# Altium schematic sheet NB-Blue.SchDoc
size A3; Organization: Altium Limited; Address1: L3, 12a Rodborough Rd; Address2: Frenchs Forest; Address3: NSW; Address4: Australia 2086
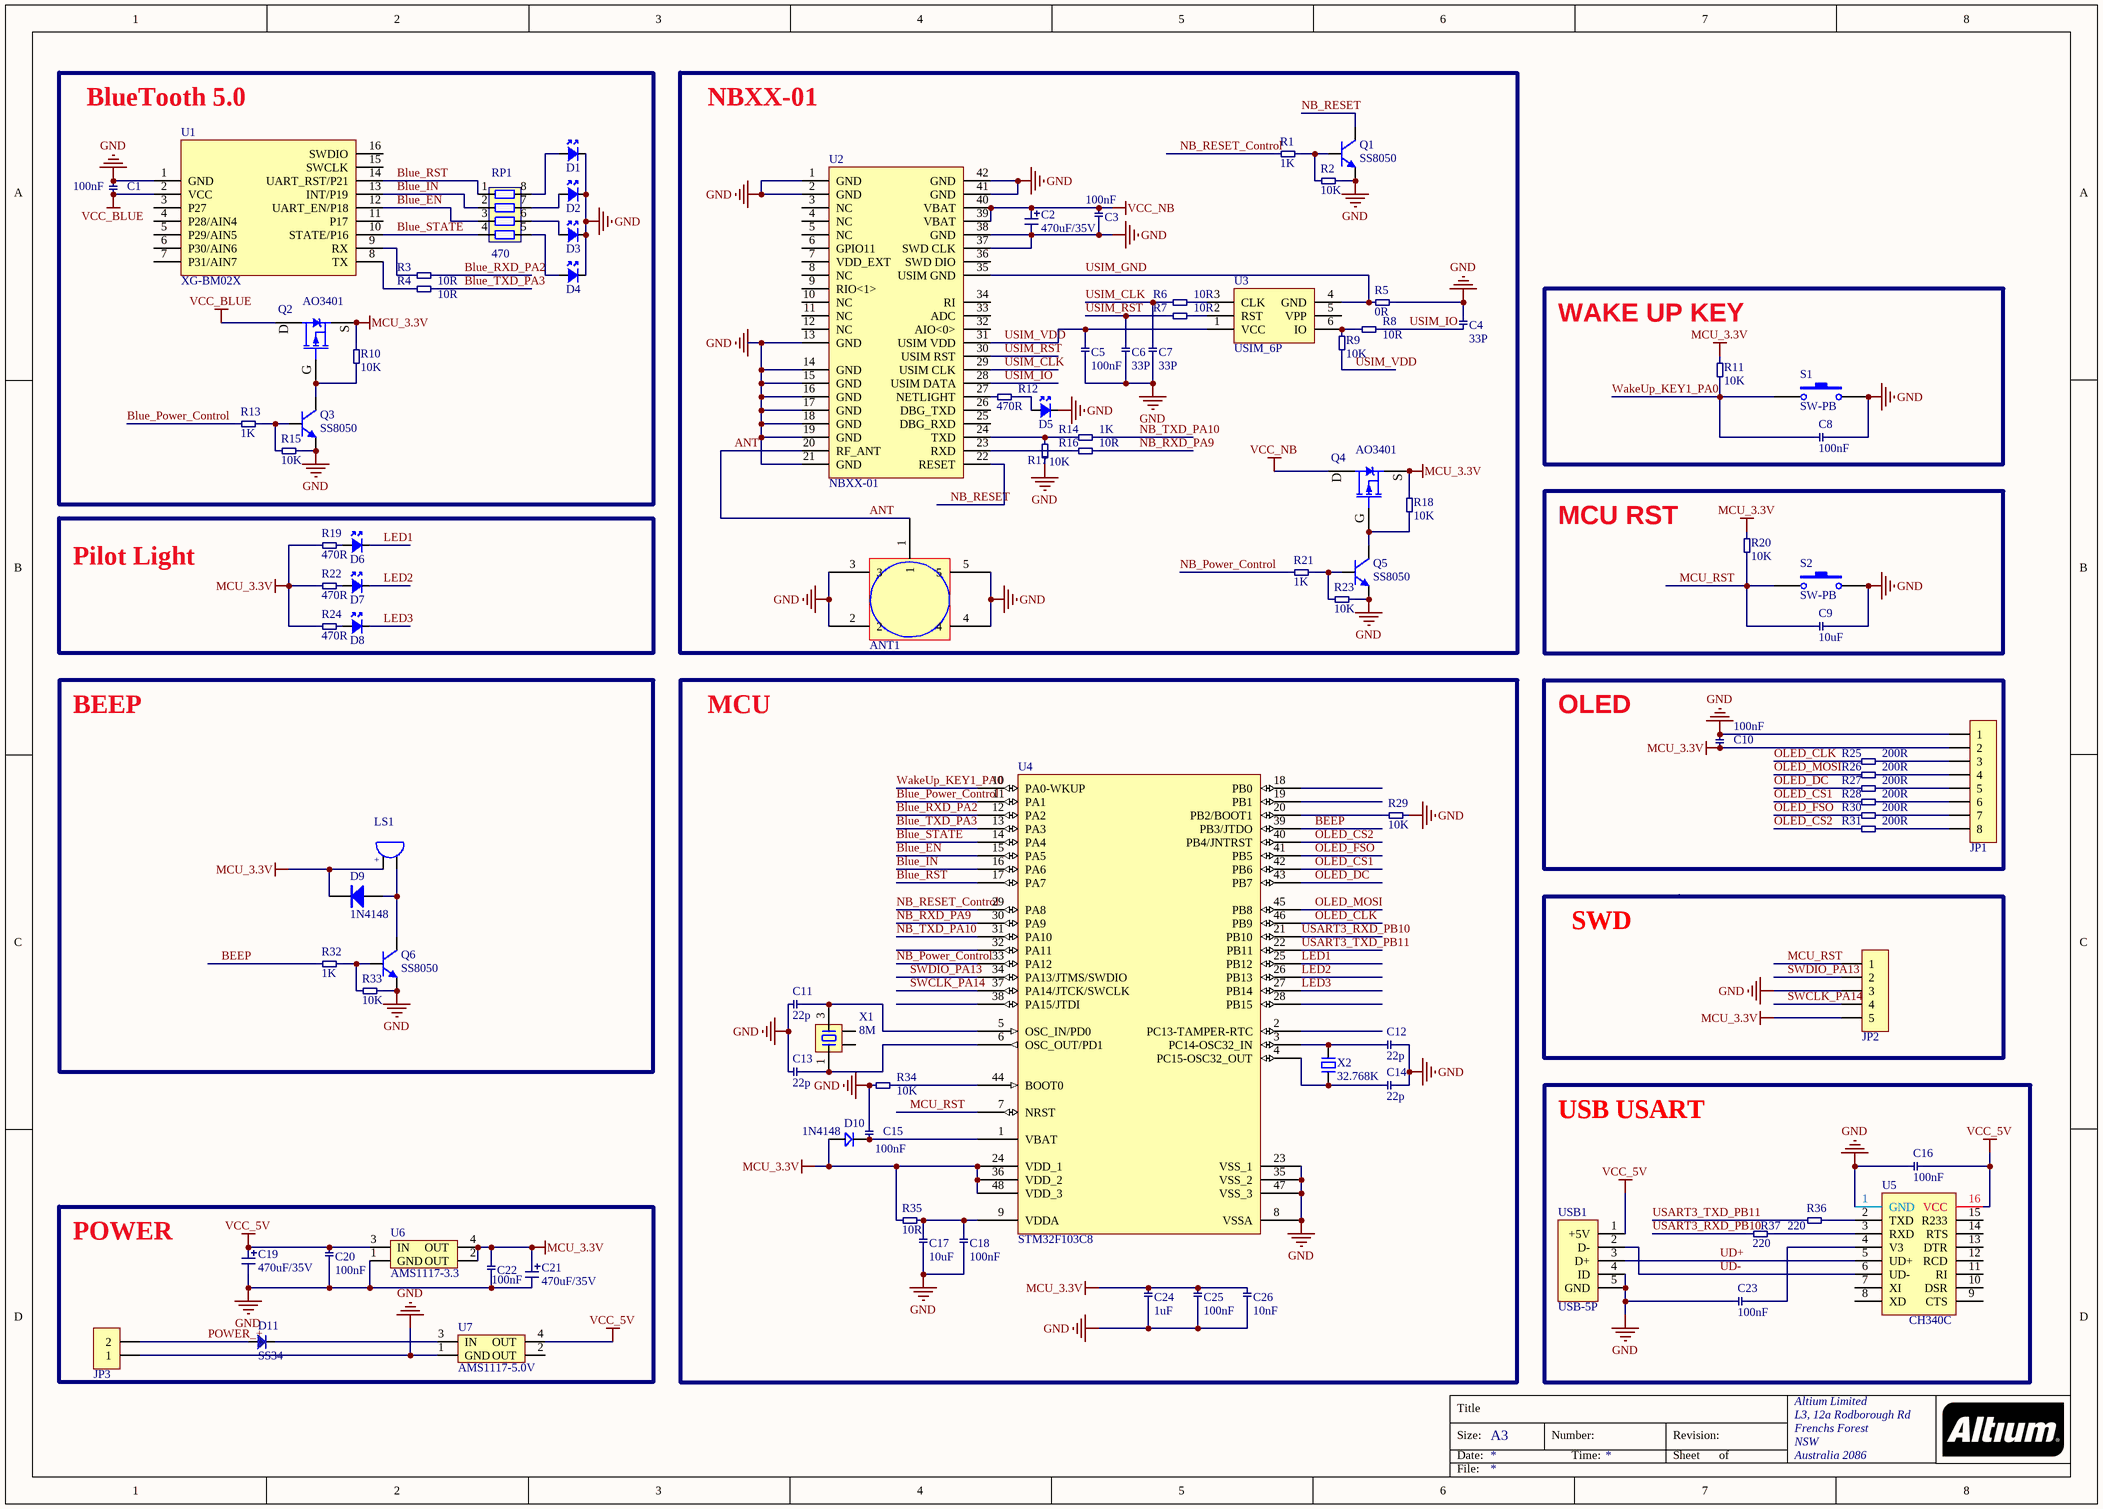
[diagram p0: NB-Blue.SchDoc]

## Parts
ANT1  ANT  [SMA_FR]  (value not drawn)
C1  100nF  [0603CC]
C2  470uF/35V  [C3216]
C3  100nF  [0603CC]
C4  33P  [0603CC]
C5  100nF  [0603CC]
C6  33P  [0603CC]
C7  33P  [0603CC]
C8  100nF  [0603CC]
C9  10uF  [0603CC]
C10  100nF  [0603CC]
C11  22p  [0603CC]
C12  22p  [0603CC]
C13  22p  [0603CC]
C14  22p  [0603CC]
C15  100nF  [0603CC]
C16  100nF  [0603CC]
C17  10uF  [0603CC]
C18  100nF  [0603CC]
C19  470uF/35V  [CD A(3216)]
C20  100nF  [0603CC]
C21  470uF/35V  [C3216]
C22  100nF  [0603CC]
C23  100nF  [0603CC]
C24  1uF  [0603CC]
C25  100nF  [0603CC]
C26  10nF  [0603CC]
D1  LED  [LED 0603G]  (value not drawn)
D2  LED  [LED 0603G]  (value not drawn)
D3  LED  [LED 0603G]  (value not drawn)
D4  LED  [LED 0603G]  (value not drawn)
D5  LED  [LED 0603G]  (value not drawn)
D6  LED  [LED 3MM-G]  (value not drawn)
D7  LED  [LED 3MM-G]  (value not drawn)
D8  LED  [LED 3MM-G]  (value not drawn)
D9  1N4148  [SOD-323]
D10  1N4148  [SOD-323]
D11  SS34  [SMA]
JP1  HDR-1X8  [HDR2.54-M-LI-8P]  (value not drawn)
JP2  HDR-1X5  [HDR2.54-LI-5P]  (value not drawn)
JP3  HDR-1X2  [XH2.54-WI-2P]  (value not drawn)
LS1  DC5V  [BEEP 5x9x5.5]  (value not drawn)
Q1  SS8050  [SOT23-3N]
Q2  AO3401  [SOT23-3N]
Q3  SS8050  [SOT23-3N]
Q4  AO3401  [SOT23-3N]
Q5  SS8050  [SOT23-3N]
Q6  SS8050  [SOT23-3N]
R1  1K  [0603RR]
R2  10K  [0603RR]
R3  10R  [0603RR]
R4  10R  [0603RR]
R5  0R  [0603RR]
R6  10R  [0603RR]
R7  10R  [0603RR]
R8  10R  [0603RR]
R9  10K  [0603RR]
R10  10K  [0603RR]
R11  10K  [0603RR]
R12  470R  [0603RR]
R13  1K  [0603RR]
R14  1K  [0603RR]
R15  10K  [0603RR]
R16  10R  [0603RR]
R17  10K  [0603RR]
R18  10K  [0603RR]
R19  470R  [0603RR]
R20  10K  [0603RR]
R21  1K  [0603RR]
R22  470R  [0603RR]
R23  10K  [0603RR]
R24  470R  [0603RR]
R25  200R  [0603RR]
R26  200R  [0603RR]
R27  200R  [0603RR]
R28  200R  [0603RR]
R29  10K  [0603RR]
R30  200R  [0603RR]
R31  200R  [0603RR]
R32  1K  [0603RR]
R33  10K  [0603RR]
R34  10K  [0603RR]
R35  10R  [0603RR]
R36  220  [0603RR]
R37  220  [0603RR]
RP1  470  [4x0603]
S1  SW-PB  [TSW SMD-6*6*6]
S2  SW-PB  [TSW SMD-4*4*1.5]
U1  XG-BM02X  [XG-BM02X]
U2  NBXX-01  [X_LSD4NBN-LB05000001]
U3  USIM_6P  [SIM 6P 自弹]
U4  STM32F103C8  [LQFP48 7X7_M]
U5  CH340C  [SOP16_L]
U6  AMS1117-3.3  [SOT223_N]
U7  AMS1117-5.0V  [SOT223_N]
USB1  USB-5P  [USB-MICRO_A]
X1  8M  [OSC 3225-4P]
X2  32.768K  [OSC 3215-2P]

## Nets
GND: ANT1.2 ANT1.3 ANT1.4 ANT1.5 C1.2 C2.2 C3.1 C4.2 C5.1 C6.1 C7.1 C8.2 C9.1 C10.2 C11.1 C12.2 C13.1 C14.2 C15.2 C16.2 C17.1 C18.1 C19.2 C20.1 C21.2 C22.1 C23.2 C24.1 C25.1 C26.1 D1.2(CATHODE) D2.2(CATHODE) D3.2(CATHODE) D4.2(CATHODE) D5.2(CATHODE) JP1.1 JP2.3 JP3.1 Q1.2(E) Q3.2(E) Q5.2(E) Q6.2(E) R2.2 R5.2 R15.2 R17.2 R23.2 R29.2 R33.2 R34.1 S1.2 S2.2 U1.1(GND) U2.1(GND) U2.2(GND) U2.13(GND) U2.14(GND) U2.15(GND) U2.16(GND) U2.17(GND) U2.18(GND) U2.19(GND) U2.21(GND) U2.37(SWD_CLK) U2.38(GND) U2.41(GND) U2.42(GND) U4.8(VSSA) U4.23(VSS_1) U4.35(VSS_2) U4.47(VSS_3) U5.1(GND) U6.1(GND) U7.1(GND) USB1.4(ID) USB1.5(GND)
MCU_3.3V: C10.1 C21.1 C22.2 C24.2 C25.2 C26.2 D9.2(K) D10.1 JP1.2 JP2.5 LS1.1 Q2.2(S) Q4.2(S) R10.2 R11.2 R18.2 R19.1 R20.2 R22.1 R24.1 R35.1 U4.24(VDD_1) U4.36(VDD_2) U4.48(VDD_3) U6.2(OUT) U6.4(OUT)
VCC_5V: C16.1 C19.1 C20.2 U5.16(VCC) U6.3(IN) U7.4(OUT) USB1.1(+5V)
VCC_BLUE: C1.1 Q2.3(D) U1.2(VCC)
VCC_NB: C2.1 C3.2 Q4.3(D) U2.39(VBAT) U2.40(VBAT)
ANT: ANT1.1 U2.20(RF_ANT)
BEEP: R32.1 U4.39(PB3/JTDO)
Blue_EN: RP1.3 U1.12(UART_EN/P18) U4.15(PA5)
Blue_IN: RP1.2 U1.13(INT/P19) U4.16(PA6)
Blue_Power_Control: R13.1 U4.11(PA1)
Blue_RST: RP1.1 U1.14(UART_RST/P21) U4.17(PA7)
Blue_RXD_PA2: R3.2 U4.12(PA2)
Blue_STATE: RP1.4 U1.10(STATE/P16) U4.14(PA4)
Blue_TXD_PA3: R4.2 U4.13(PA3)
LED1: D6.2(CATHODE) U4.25(PB12)
LED2: D7.2(CATHODE) U4.26(PB13)
LED3: D8.2(CATHODE) U4.27(PB14)
MCU_RST: C9.2 JP2.1 R20.1 S2.1 U4.7(NRST)
NB_Power_Control: R21.1 U4.33(PA12)
NB_RESET: Q1.3(C) U2.22(RESET)
NB_RESET_Control: R1.1 U4.29(PA8)
NB_RXD_PA9: R16.2 U4.30(PA9)
NB_TXD_PA10: R14.2 U4.31(PA10)
OLED_CLK: R25.1 U4.46(PB9)
OLED_CS1: R28.1 U4.42(PB6)
OLED_CS2: R31.1 U4.40(PB4/JNTRST)
OLED_DC: R27.1 U4.43(PB7)
OLED_FSO: R30.1 U4.41(PB5)
OLED_MOSI: R26.1 U4.45(PB8)
POWER_+: D11.1(ANODE) JP3.2
SWCLK_PA14: JP2.4 U4.37(PA14/JTCK/SWCLK)
SWDIO_PA13: JP2.2 U4.34(PA13/JTMS/SWDIO)
UD+: U5.5(UD+) USB1.3(D+)
UD-: U5.6(UD-) USB1.2(D-)
USART3_RXD_PB10: R37.1 U4.21(PB10)
USART3_TXD_PB11: R36.1 U4.22(PB11)
USIM_CLK: C7.2 R6.1 U2.29(USIM_CLK)
USIM_GND: R5.1 U2.35(USIM_GND) U3.4(GND)
USIM_IO: C4.1 R8.1 U2.28(USIM_DATA)
USIM_RST: C6.2 R7.1 U2.30(USIM_RST)
USIM_VDD: C5.2 R9.1 U2.31(USIM_VDD) U3.1(VCC)
WakeUp_KEY1_PA0: C8.1 R11.1 S1.1 U4.10(PA0-WKUP)
NetC11_2: C11.2 U4.5(OSC_IN/PD0) X1.3
NetC12_1: C12.1 U4.3(PC14-OSC32_IN) X2.2
NetC13_2: C13.2 U4.6(OSC_OUT/PD1) X1.1
NetC14_1: C14.1 U4.4(PC15-OSC32_OUT) X2.1
NetC15_1: C15.1 D10.2 U4.1(VBAT)
NetC17_2: C17.2 C18.2 R35.2 U4.9(VDDA)
NetC23_1: C23.1 U5.4(V3)
NetD1_1: D1.1(ANODE) RP1.8
NetD2_1: D2.1(ANODE) RP1.7
NetD3_1: D3.1(ANODE) RP1.6
NetD4_1: D4.1(ANODE) RP1.5
NetD5_1: D5.1(ANODE) R12.2
NetD6_1: D6.1(ANODE) R19.2
NetD7_1: D7.1(ANODE) R22.2
NetD8_1: D8.1(ANODE) R24.2
NetD9_1: D9.1(A) LS1.2 Q6.3(C)
NetD11_2: D11.2(CATHODE) U7.3(IN)
NetJP1_3: JP1.3 R25.2
NetJP1_4: JP1.4 R26.2
NetJP1_5: JP1.5 R27.2
NetJP1_6: JP1.6 R28.2
NetJP1_7: JP1.7 R30.2
NetJP1_8: JP1.8 R31.2
NetQ1_1: Q1.1(B) R1.2 R2.1
NetQ2_1: Q2.1(G) Q3.3(C) R10.1
NetQ3_1: Q3.1(B) R13.2 R15.1
NetQ4_1: Q4.1(G) Q5.3(C) R18.1
NetQ5_1: Q5.1(B) R21.2 R23.1
NetQ6_1: Q6.1(B) R32.2 R33.1
NetR3_1: R3.1 U1.9(RX)
NetR4_1: R4.1 U1.8(TX)
NetR6_2: R6.2 U3.3(CLK)
NetR7_2: R7.2 U3.2(RST)
NetR8_2: R8.2 R9.2 U3.6(IO)
NetR12_1: R12.1 U2.27(NETLIGHT)
NetR14_1: R14.1 R17.1 U2.24(TXD)
NetR16_1: R16.1 U2.23(RXD)
NetR29_1: R29.1 U4.20(PB2/BOOT1)
NetR34_2: R34.2 U4.44(BOOT0)
NetR36_2: R36.2 U5.2(TXD)
NetR37_2: R37.2 U5.3(RXD)

Not connected (* = marked no-connect by the designer): U1 3(P27) 4(P28/AIN4) 5(P29/AIN5) 6(P30/AIN6) 7(P31/AIN7) 11(P17) 15(SWCLK) 16(SWDIO); U2 3(NC) 4(NC) 5(NC) 6(GPIO11) 7(VDD_EXT) 8(NC) 9(RIO<1>) 10(NC) 11(NC) 12(NC) 25(DBG_RXD) 26(DBG_TXD) 32(AIO<0>) 33(ADC) 34(RI) 36(SWD_DIO); U3 5(VPP); U4 2(PC13-TAMPER-RTC) 18(PB0) 19(PB1) 28(PB15) 32(PA11) 38(PA15/JTDI); U5 7(XI) 8(XD) 9(CTS) 10(DSR) 11(RI) 12(RCD) 13(DTR) 14(RTS) 15(R233); U7 2(OUT); X1 2 4

## Notes on the sheet
- (near U1) BlueTooth 5.0
- NBXX-01
- (near R11) WAKE UP KEY
- Pilot Light
- MCU RST
- BEEP
- MCU
- OLED
- SWD
- USB USART
- POWER
- Title
- Size:
- Date:
- A3
- Number:
- Time:
- Revision:
- Sheet
- of
- File:
- (in symbol BEEP) +

## Library data of the parts
ANT1 = ANT: SMA天线座; pin to pad: 3>2 4>3 5>3
C1 C3-C18 C20 C22-C26 = cap
C2 C19 C21 = Ecap
D9 = 1N4148: 高速开关二极管; 版权归属: 源创客; BOM名称: 高速开关二极管; 学习资源: www.ooocke.com
D10 = D
D11 = Diod
JP1 = Header 8: 8P接插件; 版权归属: 源创客; BOM名称: 8P接插件; 学习资源: www.ooocke.com
JP2 = Header 5: 5P接插件; 版权归属: 源创客; BOM名称: 5P接插件; 学习资源: www.ooocke.com
JP3 = Header 2: 2P接插件; 版权归属: 源创客; BOM名称: 2P接插件; 学习资源: www.ooocke.com
LS1 = BEEP: 蜂鸣器; 版权归属: 源创客; BOM名称: 蜂鸣器; 学习资源: www.ooocke.com
Q1 Q3 Q5 Q6 = 8050-SMD: 高频放大-NPN型; 版权归属: 源创客; 属性: 40V 1.5A 1W 100MHZ; BOM名称: 高频放大-NPN型; 学习资源: www.ooocke.com
Q2 Q4 = SI2301: P沟道场效应管; 版权归属: 源创客; BOM名称: P沟道场效应管; 学习资源: www.ooocke.com
R1-R37 = res
RP1 = Resistor_Pack
S1 S2 = SW-PB: Switch; Published: 24-Mar-1999; LatestRevisionDate: 17-Jul-2002; LatestRevisionNote: Re-released for DXP Platform.; PackageReference: SPST-2; Publisher: Altium Limited
U2 = NB
U3 = USIM-6P
U4 = STM32F103C8: Flaah:64/RAM:20/IO:36; BOM名称: 32位STM单片机; 版权归属: 源创客; 学习资源: www.ooocke.com
U6 U7 = AMS1117
USB1 = USB-5P: 微型USB母座; 版权归属: 源创客; BOM名称: 微型USB母座; 学习资源: www.ooocke.com
X1 = XTAL-4P: 4脚无源晶振; 版权归属: 源创客; BOM名称: 4脚无源晶振; 学习资源: www.ooocke.com
X2 = XTAL-2P: 2脚无源脚晶振; 版权归属: 源创客; BOM名称: 2脚无源脚晶振; 学习资源: www.ooocke.com